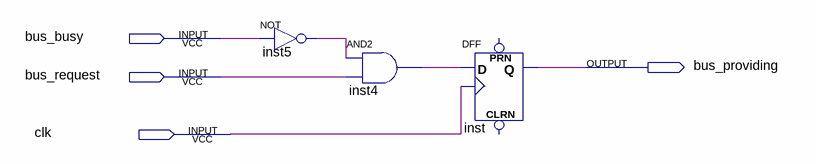
[diagram p0: schematic sheet]
// Quartus schematic arbitr.bdf as structural Verilog: 3 symbols, 4 pins
module arbitr (
  input  bus_busy,
  input  bus_request,
  input  clk,
  output bus_providing
);

  wire inst4_out, inst5_out;

  not inst5 (inst5_out, bus_busy);
  and inst4 (inst4_out, inst5_out, bus_request);
  DFF inst (.CLK(clk), .D(inst4_out), .Q(bus_providing));  // open: CLRN, PRN
endmodule
